# EAGLE schematic Raspberry_Pi_Circuit_Board_2 (EAGLE 9.6.2)
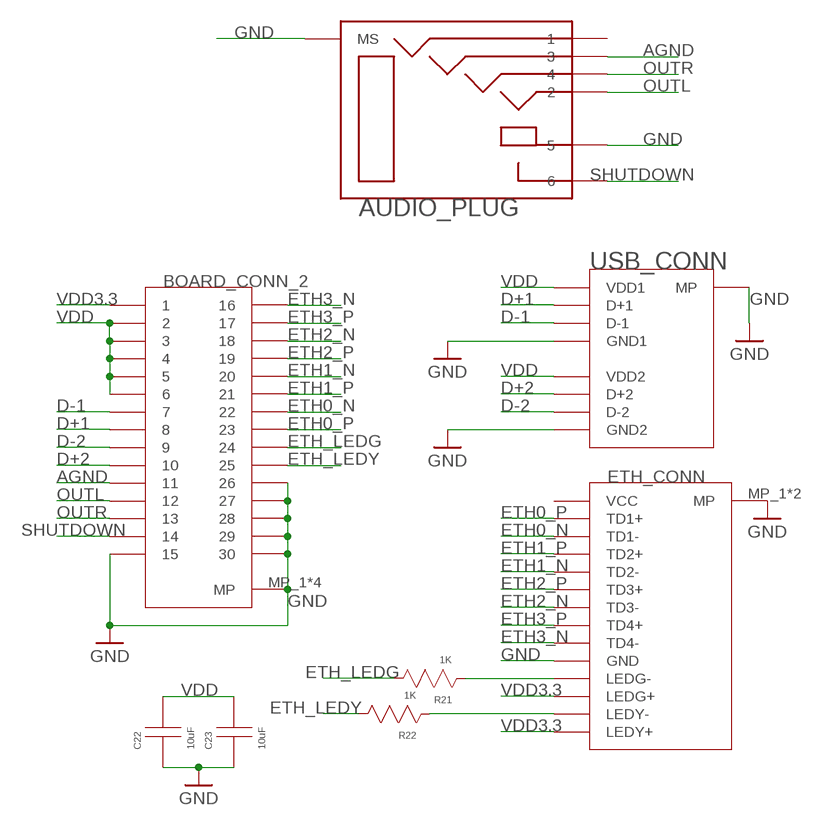
[diagram p0: schematic, sheet 1]

## Parts
AUDIO_PLUG  AUDIOPLUG-ASJ-192-Y-TR  [AUDIOPLUG-ASJ-192-Y-TR]
BOARD_CONN_2  MEZZANINE-AXT530124  [MEZZANINE-AXT530124]
C22  10uF  CAP-603  [CAP-603]
C23  10uF  CAP-603  [CAP-603]
ETH_CONN  ETH-GLPLX-SMT-188S7-QQ-Y/G  [ETH-GLPLX-SMT-188S7-QQ-Y/G]
R21  1K  RES-603  [RES-603]
R22  1K  RES-603  [RES-603]
USB_CONN  USB-614108646521  [USB-614108646521]

## Nets
AGND: AUDIO_PLUG.3 BOARD_CONN_2.11
D+1: BOARD_CONN_2.8 USB_CONN.D+1
D+2: BOARD_CONN_2.10 USB_CONN.D+2
D-1: BOARD_CONN_2.7 USB_CONN.D-1
D-2: BOARD_CONN_2.9 USB_CONN.D-2
ETH0_N: BOARD_CONN_2.22 ETH_CONN.TD1-
ETH0_P: BOARD_CONN_2.23 ETH_CONN.TD1+
ETH1_N: BOARD_CONN_2.20 ETH_CONN.TD2-
ETH1_P: BOARD_CONN_2.21 ETH_CONN.TD2+
ETH2_N: BOARD_CONN_2.18 ETH_CONN.TD3-
ETH2_P: BOARD_CONN_2.19 ETH_CONN.TD3+
ETH3_N: BOARD_CONN_2.16 ETH_CONN.TD4-
ETH3_P: BOARD_CONN_2.17 ETH_CONN.TD4+
ETH_LEDG: BOARD_CONN_2.24 R21.C
ETH_LEDY: BOARD_CONN_2.25 R22.C
GND: AUDIO_PLUG.5 AUDIO_PLUG.MS1(MS) AUDIO_PLUG.MS2(MS) BOARD_CONN_2.15 BOARD_CONN_2.26 BOARD_CONN_2.27 BOARD_CONN_2.28 BOARD_CONN_2.29 BOARD_CONN_2.30 BOARD_CONN_2.MP_1(MP) BOARD_CONN_2.MP_2(MP) BOARD_CONN_2.MP_3(MP) BOARD_CONN_2.MP_4(MP) C22.A C23.A ETH_CONN.GND ETH_CONN.MP_1(MP) ETH_CONN.MP_2(MP) USB_CONN.GND1 USB_CONN.GND2 USB_CONN.MP_1(MP) USB_CONN.MP_2(MP) USB_CONN.MP_3(MP) USB_CONN.MP_4(MP)
N$1: ETH_CONN.LEDG- R21.A
N$2: ETH_CONN.LEDY- R22.A
OUTL: AUDIO_PLUG.2 BOARD_CONN_2.12
OUTR: AUDIO_PLUG.4 BOARD_CONN_2.13
SHUTDOWN: AUDIO_PLUG.6 BOARD_CONN_2.14
VDD: BOARD_CONN_2.2 BOARD_CONN_2.3 BOARD_CONN_2.4 BOARD_CONN_2.5 BOARD_CONN_2.6 C22.C C23.C USB_CONN.VDD1 USB_CONN.VDD2
VDD3.3: BOARD_CONN_2.1 ETH_CONN.LEDG+ ETH_CONN.LEDY+
Unconnected: AUDIO_PLUG.1 ETH_CONN.VCC

## Library data of the parts
AUDIO_PLUG = Personal:AUDIOPLUG-ASJ-192-Y-TR
BOARD_CONN_2 = Personal:MEZZANINE-AXT530124
C22 C23 = Personal:CAP-603
ETH_CONN = Personal:ETH-GLPLX-SMT-188S7-QQ-Y/G
R21 R22 = Personal:RES-603
USB_CONN = Personal:USB-614108646521